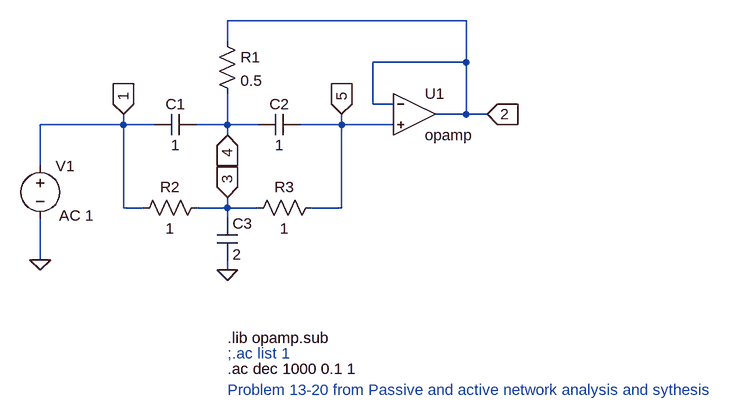
[diagram p0: schematic 2nd order BRF.asc]
2nd order BRF.asc, the LTspice schematic file:
Version 4
SHEET 1 1020 680
WIRE 240 -224 -128 -224
WIRE -128 -192 -128 -224
WIRE 240 -160 240 -224
WIRE 240 -160 96 -160
WIRE 96 -96 96 -160
WIRE 128 -96 96 -96
WIRE 240 -80 240 -160
WIRE 240 -80 192 -80
WIRE 272 -80 240 -80
WIRE -288 -64 -288 -80
WIRE -288 -64 -416 -64
WIRE -240 -64 -288 -64
WIRE -128 -64 -128 -112
WIRE -128 -64 -176 -64
WIRE -80 -64 -128 -64
WIRE 48 -64 48 -80
WIRE 48 -64 -16 -64
WIRE 128 -64 48 -64
WIRE -128 -48 -128 -64
WIRE -416 0 -416 -64
WIRE -288 64 -288 -64
WIRE -256 64 -288 64
WIRE -128 64 -128 48
WIRE -128 64 -176 64
WIRE -80 64 -128 64
WIRE 48 64 48 -64
WIRE 48 64 0 64
WIRE -128 80 -128 64
WIRE -416 144 -416 80
WIRE -128 160 -128 144
FLAG -128 160 0
FLAG -416 144 0
FLAG -288 -80 1
IOPIN -288 -80 In
FLAG -128 -48 4
IOPIN -128 -48 In
FLAG -128 48 3
IOPIN -128 48 In
FLAG 48 -80 5
IOPIN 48 -80 In
FLAG 272 -80 2
IOPIN 272 -80 In
SYMBOL OpAmps\\opamp 160 -144 R0
SYMATTR InstName U1
SYMBOL voltage -416 -16 R0
WINDOW 123 29 92 Left 2
WINDOW 39 0 0 Left 0
SYMATTR Value2 AC 1
SYMATTR InstName V1
SYMATTR Value ""
SYMBOL cap -144 80 R0
SYMATTR InstName C3
SYMATTR Value 2
SYMBOL cap -176 -80 R90
WINDOW 0 0 32 VBottom 2
WINDOW 3 32 32 VTop 2
SYMATTR InstName C1
SYMATTR Value 1
SYMBOL cap -16 -80 R90
WINDOW 0 0 32 VBottom 2
WINDOW 3 32 32 VTop 2
SYMATTR InstName C2
SYMATTR Value 1
SYMBOL res -144 -208 R0
SYMATTR InstName R1
SYMATTR Value 0.5
SYMBOL res -160 48 R90
WINDOW 0 0 56 VBottom 2
WINDOW 3 32 56 VTop 2
SYMATTR InstName R2
SYMATTR Value 1
SYMBOL res 16 48 R90
WINDOW 0 0 56 VBottom 2
WINDOW 3 32 56 VTop 2
SYMATTR InstName R3
SYMATTR Value 1
TEXT -128 288 Left 2 ;;.ac list 1
TEXT -128 264 Left 2 !.lib opamp.sub
TEXT -128 312 Left 2 !.ac dec 1000 0.1 1
TEXT -128 344 Left 2 ;Problem 13-20 from Passive and active network analysis and sythesis

The netlist it stands for:
* 2nd order BRF.asc
XU1 2 5 2 opamp Aol=100K GBW=10Meg  ; pins invin noninvin out
V1 1 0 AC 1
C3 3 0 2
C1 4 1 1
C2 5 4 1
R1 2 4 0.5
R2 3 1 1
R3 5 3 1
* ;.ac list 1
.lib opamp.sub
.ac dec 1000 0.1 1
* Problem 13-20 from Passive and active network analysis and sythesis
.backanno
.end